# Altium schematic sheet crw_controller.SchDoc
size A
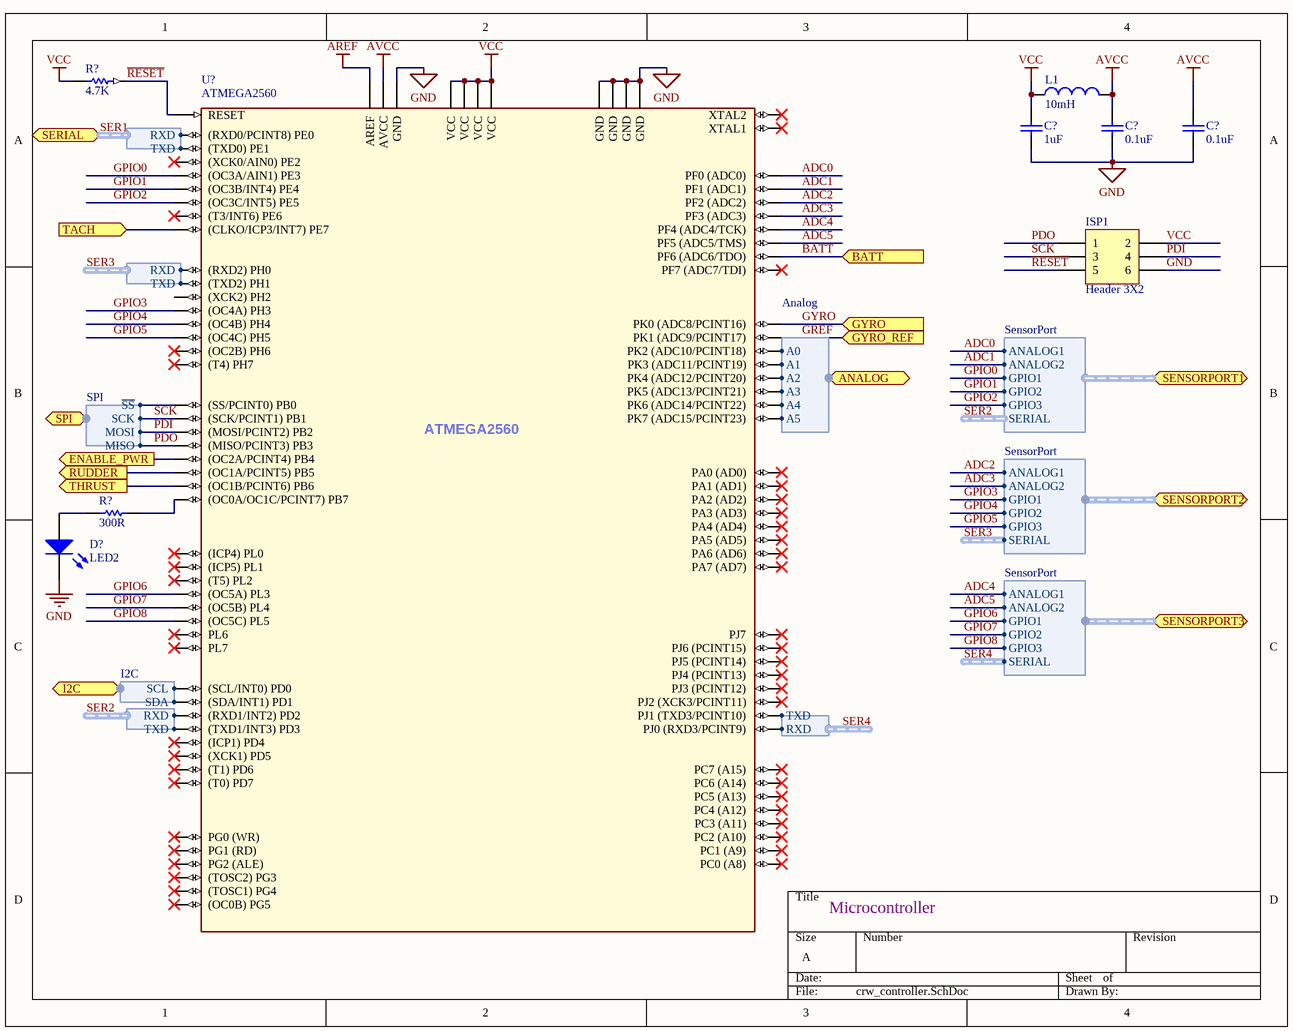
[diagram p0: crw_controller.SchDoc]

## Parts
(Parts that share a designator on the sheet are numbered #1, #2 ... from top to bottom, then left to right.)
C?#1  value 1uF  [0805]  (hidden comment: C0805)
C?#2  value 0.1uF  [0805]  (hidden comment: C0805)
C?#3  value 0.1uF  [0805]  (hidden comment: C0805)
D?  LED2  [3.2X1.6X1.1]
ISP1  Header 3X2  [HDR2X3]
L1  value 10mH  [3261]  (hidden comment: Inductor)
R?#1  value 4.7K  [2012[0805]]  (hidden comment: Res Semi)
R?#2  value 300R  [2012[0805]]  (hidden comment: Res Semi)
U?  ATMEGA2560  [MY_ATMEGA2560]

## Ports
ANALOG (harness Analog), BATT (in), ENABLE_PWR (out), GYRO (in), GYRO_REF (in), I2C (harness I2C), RUDDER (out), SENSORPORT1 (harness SensorPort), SENSORPORT2 (harness SensorPort), SENSORPORT3 (harness SensorPort), SERIAL (harness Serial), SPI (harness SPI), TACH (in), THRUST (out)

## Harnesses
Serial: RXD, TXD
SensorPort: ANALOG1, ANALOG2, GPIO1, GPIO2, GPIO3, SERIAL
Analog: A0, A1, A2, A3, A4, A5
SPI: ~{SS}, SCK, MISO, MOSI
I2C: SDA, SCL

## Nets
AREF: U?.98(AREF)
AVCC: C?#2.2 C?#3.2 L1.2 U?.100(AVCC)
GND: C?#1.1 C?#2.1 C?#3.1 D?.2(K) ISP1.6 U?.11(GND) U?.32(GND) U?.62(GND) U?.81(GND) U?.99(GND)
VCC: C?#1.2 ISP1.2 L1.1 R?#1.1 U?.10(VCC) U?.31(VCC) U?.61(VCC) U?.80(VCC)
ADC0: U?.97(PF0_(ADC0)) ; port SENSORPORT1.ANALOG1
ADC1: U?.96(PF1_(ADC1)) ; port SENSORPORT1.ANALOG2
ADC2: U?.95(PF2_(ADC2)) ; port SENSORPORT2.ANALOG1
ADC3: U?.94(PF3_(ADC3)) ; port SENSORPORT2.ANALOG2
ADC4: U?.93(PF4_(ADC4/TCK)) ; port SENSORPORT3.ANALOG1
ADC5: U?.92(PF5_(ADC5/TMS)) ; port SENSORPORT3.ANALOG2
BATT: U?.91(PF6_(ADC6/TDO)) ; port BATT
ENABLE_PWR: U?.23((OC2A/PCINT4)_PB4) ; port ENABLE_PWR
GPIO0: U?.5((OC3A/AIN1)_PE3) ; port SENSORPORT1.GPIO1
GPIO1: U?.6((OC3B/INT4)_PE4) ; port SENSORPORT1.GPIO2
GPIO2: U?.7((OC3C/INT5)_PE5) ; port SENSORPORT1.GPIO3
GPIO3: U?.15((OC4A)_PH3) ; port SENSORPORT2.GPIO1
GPIO4: U?.16((OC4B)_PH4) ; port SENSORPORT2.GPIO2
GPIO5: U?.17((OC4C)_PH5) ; port SENSORPORT2.GPIO3
GPIO6: U?.38((OC5A)_PL3) ; port SENSORPORT3.GPIO1
GPIO7: U?.39((OC5B)_PL4) ; port SENSORPORT3.GPIO2
GPIO8: U?.40((OC5C)_PL5) ; port SENSORPORT3.GPIO3
GREF: U?.88(PK1_(ADC9/PCINT17)) ; port GYRO_REF
GYRO: U?.89(PK0_(ADC8/PCINT16)) ; port GYRO
PDI: ISP1.4 U?.21((MOSI/PCINT2)_PB2) ; port SPI.MOSI
PDO: ISP1.1 U?.22((MISO/PCINT3)_PB3) ; port SPI.MISO
~{RESET}: ISP1.5 R?#1.2 U?.30(RESET)
RUDDER: U?.24((OC1A/PCINT5)_PB5) ; port RUDDER
SCK: ISP1.3 U?.20((SCK/PCINT1)_PB1) ; port SPI.SCK
SER2.RXD: U?.45((RXD1/INT2)_PD2) ; harness Serial.RXD
SER2.TXD: U?.46((TXD1/INT3)_PD3) ; harness Serial.TXD
SER4.RXD: U?.63(PJ0_(RXD3/PCINT9)) ; harness Serial.RXD
SER4.TXD: U?.64(PJ1_(TXD3/PCINT10)) ; harness Serial.TXD
TACH: U?.9((CLKO/ICP3/INT7)_PE7) ; port TACH
THRUST: U?.25((OC1B/PCINT6)_PB6) ; port THRUST
NetD?_1: D?.1(A) R?#2.1
NetR?#2_2: R?#2.2 U?.26((OC0A/OC1C/PCINT7)_PB7)
NetU?_19: U?.19((SS/PCINT0)_PB0) ; port SPI.~{SS}
NetU?_43: U?.43((SCL/INT0)_PD0) ; port I2C.SCL
NetU?_44: U?.44((SDA/INT1)_PD1) ; port I2C.SDA
NetU?_82: U?.82(PK7_(ADC15/PCINT23)) ; port ANALOG.A5
NetU?_83: U?.83(PK6_(ADC14/PCINT22)) ; port ANALOG.A4
NetU?_84: U?.84(PK5_(ADC13/PCINT21)) ; port ANALOG.A3
NetU?_85: U?.85(PK4_(ADC12/PCINT20)) ; port ANALOG.A2
NetU?_86: U?.86(PK3_(ADC11/PCINT19)) ; port ANALOG.A1
NetU?_87: U?.87(PK2_(ADC10/PCINT18)) ; port ANALOG.A0

Not connected (* = marked no-connect by the designer): U? 1((OC0B)_PG5)* 2((RXD0/PCINT8)_PE0) 3((TXD0)_PE1) 4((XCK0/AIN0)_PE2)* 8((T3/INT6)_PE6)* 12((RXD2)_PH0) 13((TXD2)_PH1) 14((XCK2)_PH2) 18((OC2B)_PH6)* 27((T4)_PH7)* 28((TOSC2)_PG3)* 29((TOSC1)_PG4)* 33(XTAL2)* 34(XTAL1)* 35((ICP4)_PL0)* 36((ICP5)_PL1)* 37((T5)_PL2)* 41(PL6)* 42(PL7)* 47((ICP1)_PD4)* 48((XCK1)_PD5)* 49((T1)_PD6)* 50((T0)_PD7)* 51(PG0_(WR))* 52(PG1_(RD))* 53(PC0_(A8))* 54(PC1_(A9))* 55(PC2_(A10))* 56(PC3_(A11))* 57(PC4_(A12))* 58(PC5_(A13))* 59(PC6_(A14))* 60(PC7_(A15))* 65(PJ2_(XCK3/PCINT11))* 66(PJ3_(PCINT12))* 67(PJ4_(PCINT13))* 68(PJ5_(PCINT14))* 69(PJ6_(PCINT15))* 70(PG2_(ALE))* 71(PA7_(AD7))* 72(PA6_(AD6))* 73(PA5_(AD5))* 74(PA4_(AD4))* 75(PA3_(AD3))* 76(PA2_(AD2))* 77(PA1_(AD1))* 78(PA0_(AD0))* 79(PJ7)* 90(PF7_(ADC7/TDI))*

## Buses and harness runs
harness SER1 = port SERIAL

## Notes on the sheet
- Microcontroller

## Library data of the parts
C?#1-C?#3 = C0805: Ceramic Chip Capacitor - Standard; Note: Footprint corresponds to dimensions for bulk cassette packaging. This case size has tightened tolerances.; Published: 17-Jul-2002; LatestRevisionDate: 19-Mar-2004; LatestRevisionNote: Silkscreen size reduced.; DatasheetDocument: Mar-2001; PackageDocument: Mar-2001; PackageReference: 0805; Publisher: Altium Limited; Code_JEITA: 0805; Code_IPC: 2012[0805]; ComponentLink1Description: Manufacturer Link; ComponentLink1URL: http://www.kemet.com/; ComponentLink2Description: Datasheet; ComponentLink2URL: http://www.kemet.com/kemet/web/homepage/kechome.nsf/vapubfilesname/F3102TA.pdf/$file/F3102TA.pdf
D? = LED2: Typical RED, GREEN, YELLOW, AMBER GaAs LED; Published: 8-Jun-2000; LatestRevisionDate: 17-Jul-2002; LatestRevisionNote: Re-released for DXP Platform.; PackageDocument: Feb-2002; PackageReference: 3.2X1.6X1.1; Publisher: Altium Limited
ISP1 = Header 3X2: Header, 3-Pin, Dual row; LatestRevisionDate: 17-Jul-2002; LatestRevisionNote: Re-released for DXP Platform.; Publisher: Altium Limited
L1 = Inductor: Code_IEC: 1005; Published: 8-Jun-2000; LatestRevisionDate: 17-Jul-2002; LatestRevisionNote: Re-released for DXP Platform.; PackageReference: 0402-A; Publisher: Altium Limited; Code_JEITA: 0402
R?#1 R?#2 = Res Semi: Semiconductor Resistor; Published: 8-Jun-2000; LatestRevisionDate: 17-Jul-2002; LatestRevisionNote: Re-released for DXP Platform.; PackageReference: AXIAL-0.5; Publisher: Altium Limited
U? = ATMEGA2560: AVR 256K Bytes of In-System Programmable Flash Memory